# EAGLE design eu-ir (EAGLE 6.1)
AUTHOR: Vlastimil Slintak; REV: RevA
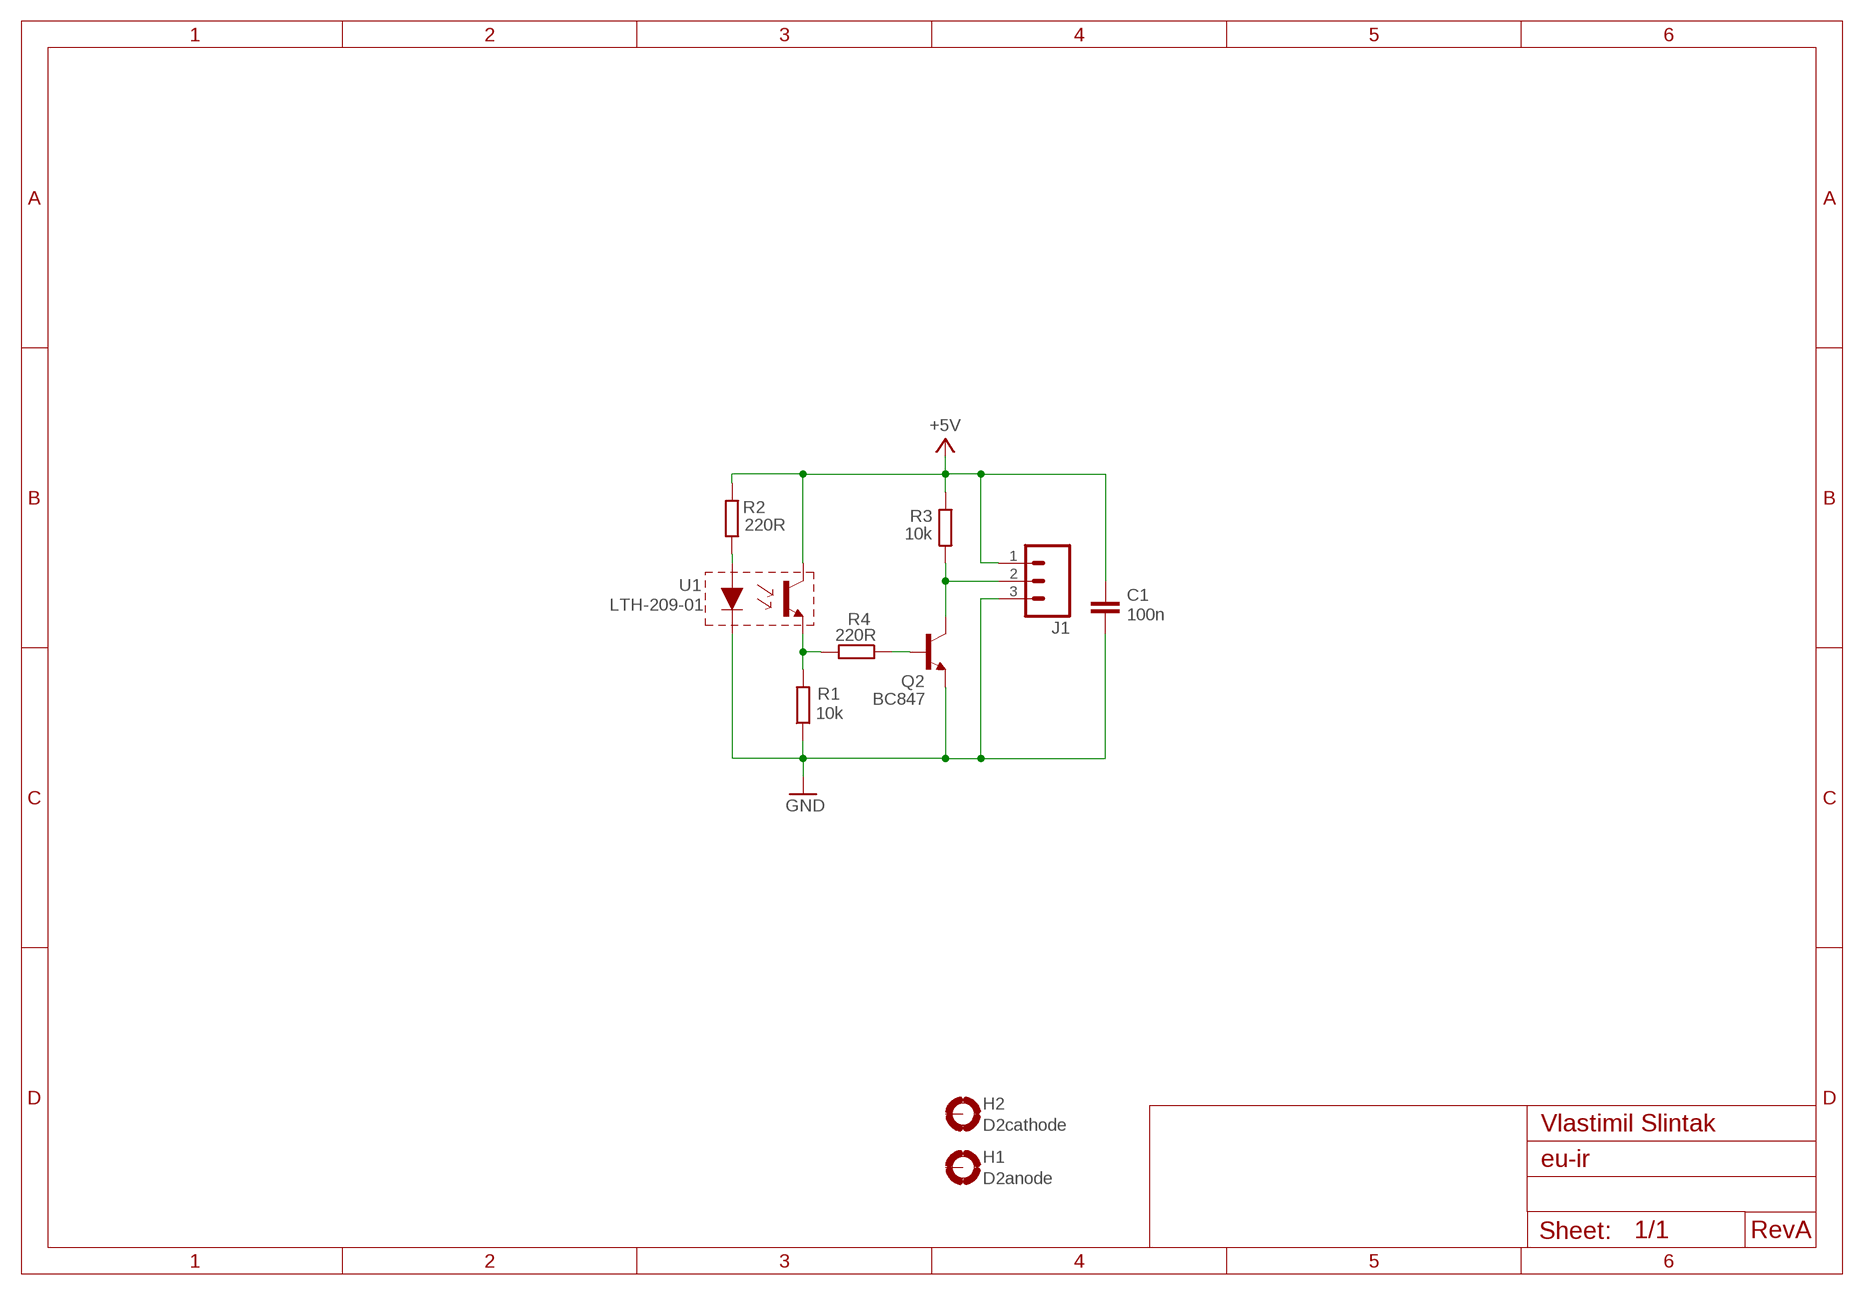
[diagram p0: schematic, sheet 1]

## Parts
C1  100n  C-EUC0603  [C0603]
H1  D2anode  MOUNT-PAD-ROUND4.1  [4,1-PAD]
H2  D2cathode  MOUNT-PAD-ROUND4.1  [4,1-PAD]
J1  M03POLAR  [MOLEX-1X3]
Q2  BC847  BC847ALT1SMD  [SOT23]
R1  10k  R-EU_R0603  [R0603]
R2  220R  R-EU_R0603  [R0603]
R3  10k  R-EU_R0603  [R0603]
R4  220R  R-EU_R0603  [R0603]
U1  LTH-209-01  [LTH209]

## Nets
+5V: C1.1 J1.1 R2.2 R3.1 U1.T4(C)
GND: C1.2 J1.3 Q2.2(E) R1.1 U1.D2(D-)
N$1: R2.1 U1.D1(D+)
N$3: R1.2 R4.2 U1.T3(E)
N$4: J1.2 Q2.3(C) R3.2
N$5: Q2.1(B) R4.1
Unconnected: H1.B4,1(MOUNT) H2.B4,1(MOUNT)

## Library data of the parts
C1 = rcl:C-EU: CAPACITOR, European symbol
H1 H2 = holes:MOUNT-PAD-ROUND: MOUNTING PAD, round
J1 = SparkFun-Connectors:M03: Header 3 Standard 3-pin 0.1" header. Use with straight break away headers (SKU : PRT-00116), right angle break away headers (PRT-00553), swiss pins (PRT-00743), machine pins (PRT-00117), and female headers (PRT-00115). Molex polarized connector foot print use with SKU : PRT-08232 with associated crimp pins and housings.
Q2 = transistor-npn:BC847*: NPN Transistor
R1-R4 = rcl:R-EU_: RESISTOR, European symbol
U1 = uArt:LTH-209-01

## Board
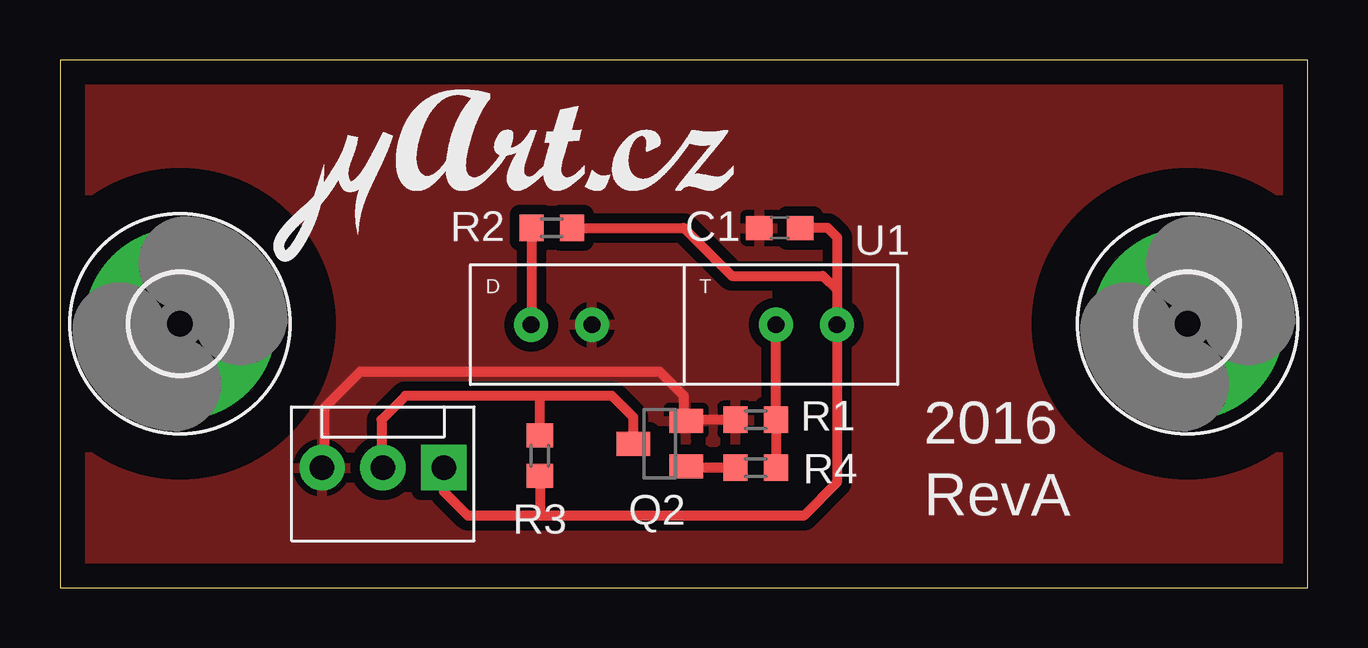
[diagram p1: board, top side]

Size 52 x 22 mm. Coordinates in mm from the lower left corner, seen from the top.
Outline: 0,0 52,0 52,22 0,22 0,0
Copper layers (1*16): Top 0.035mm / dielectric 1.5mm / Bottom 0.035mm
Design rules: minimum track width 10mil, minimum drill 24mil, track to track 8mil, track to pad 8mil, pad to pad 8mil, via to via 8mil, smd to smd 8mil, copper to edge 40mil, drill to drill 8mil, minimum pad ring 10mil, minimum via ring 8mil, stop-mask expansion 4mil, vias tented up to drill 0mil, thermal gap 10mil

### Footprints (pad centres in the part's own frame; a part is rotated, then mirrored left to right if it is on the bottom)
C0603 = smd 1.1 x 1: 1 -0.85,0; 2 0.85,0
4,1-PAD = drill 4.1 pad 8: B4,1 0,0
MOLEX-1X3 = drill 1.016 pad 1.88 square: 1 0,0 | drill 1.016 pad 1.88: 2 2.54,0; 3 5.08,0
SOT23 = smd 1 x 1.4: 1 -0.95,-1.1; 2 0.95,-1.1; 3 0,1.1
R0603 = smd 1 x 1.1: 1 -0.85,0; 2 0.85,0
LTH209 = drill 0.7 pad 1.422: D1 -6.36,-0.04; D2 -3.82,-0.04; T3 3.84,-0.04; T4 6.38,-0.04

### Placement (x,y rotation side)
C1  30,15 180 top
H1  5,11 0 top
H2  47,11 0 top
J1  16,5 180 top
Q2  25,6 90 top
R1  29,7 0 top
R2  20.5,15 0 top
R3  20,5.5 90 top
R4  29,5 0 top
U1  26,11 0 top
U$1  [UART-LOGO]  8.9,13.6 0 top

### Tracks (layer width: path | path; a pad name or v marks a point on that pad's centre or on a via)
+5V
  Top 0.406: 20,3 31,3 32.38,4.38 U1.T4 32.4,10.98 32.4,12.4 | 20,3 17,3 16,4 J1.1 | R3.1 20,3 | 32.4,12.4 32.4,14.6 32,15 C1.1 | R2.2 26,15 28,13 31.8,13 32.4,12.4
GND
  Top 0.406: R1.1 26.1,7 Q2.2 26,7.05 26,8 25,9 12.5,9 11,7.5 11,5.08 J1.3
  pour Top (isolate 0.406): 0,0 52,0 52,22 0,22
N$1
  Top 0.406: R2.1 U1.D1
N$3
  Top 0.406: U1.T3 R1.2 R4.2
N$4
  Top 0.406: Q2.3 23.9,7.1 23,8 20,8 | 20,8 14.4,8 13.4,7 13.4,5.06 J1.2 | R3.2 20,8
N$5
  Top 0.406: R4.1 26.1,5 Q2.1

### Text on the board
tPlace: 2016 | RevA